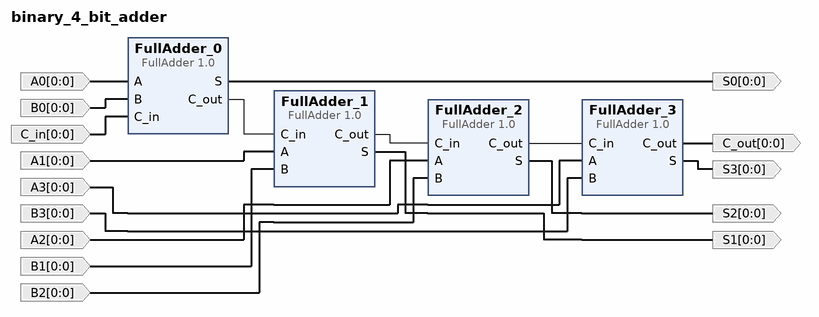
[diagram p0: block diagram of the top level]
# Vivado block design binary_4_bit_adder, xc7vx485tffg1157-1, Vivado 2019.1
create_bd_design binary_4_bit_adder

create_bd_port -dir O -from 0 -to 0 C_out
create_bd_port -dir O -from 0 -to 0 S0
create_bd_port -dir O -from 0 -to 0 S1
create_bd_port -dir O -from 0 -to 0 S2
create_bd_port -dir O -from 0 -to 0 S3
create_bd_port -dir I -from 0 -to 0 A3
create_bd_port -dir I -from 0 -to 0 B3
create_bd_port -dir I -from 0 -to 0 A2
create_bd_port -dir I -from 0 -to 0 B2
create_bd_port -dir I -from 0 -to 0 A1
create_bd_port -dir I -from 0 -to 0 B1
create_bd_port -dir I -from 0 -to 0 A0
create_bd_port -dir I -from 0 -to 0 B0
create_bd_port -dir I -from 0 -to 0 C_in

create_bd_cell -type ip -vlnv Group5:user:FullAdder:1.0 FullAdder_0
create_bd_cell -type ip -vlnv Group5:user:FullAdder:1.0 FullAdder_1
create_bd_cell -type ip -vlnv Group5:user:FullAdder:1.0 FullAdder_2
create_bd_cell -type ip -vlnv Group5:user:FullAdder:1.0 FullAdder_3

# ---- connections ----

connect_bd_net [get_bd_pins FullAdder_0/C_out] [get_bd_pins FullAdder_1/C_in]
connect_bd_net [get_bd_pins FullAdder_1/C_out] [get_bd_pins FullAdder_2/C_in]
connect_bd_net [get_bd_pins FullAdder_2/C_out] [get_bd_pins FullAdder_3/C_in]
connect_bd_net [get_bd_pins FullAdder_3/C_out] [get_bd_ports C_out]
connect_bd_net [get_bd_pins FullAdder_0/S] [get_bd_ports S0]
connect_bd_net [get_bd_pins FullAdder_1/S] [get_bd_ports S1]
connect_bd_net [get_bd_pins FullAdder_2/S] [get_bd_ports S2]
connect_bd_net [get_bd_pins FullAdder_3/S] [get_bd_ports S3]
connect_bd_net -net A3_1 [get_bd_ports A3] [get_bd_pins FullAdder_3/A]
connect_bd_net -net B3_1 [get_bd_ports B3] [get_bd_pins FullAdder_3/B]
connect_bd_net -net A2_1 [get_bd_ports A2] [get_bd_pins FullAdder_2/A]
connect_bd_net -net B2_1 [get_bd_ports B2] [get_bd_pins FullAdder_2/B]
connect_bd_net -net A1_1 [get_bd_ports A1] [get_bd_pins FullAdder_1/A]
connect_bd_net -net B1_1 [get_bd_ports B1] [get_bd_pins FullAdder_1/B]
connect_bd_net -net A0_1 [get_bd_ports A0] [get_bd_pins FullAdder_0/A]
connect_bd_net -net B0_1 [get_bd_ports B0] [get_bd_pins FullAdder_0/B]
connect_bd_net [get_bd_ports C_in] [get_bd_pins FullAdder_0/C_in]

validate_bd_design
save_bd_design
